# EAGLE design Motor-Board-Rev1 (EAGLE 7.6.0)

## Sheet 1 of 3
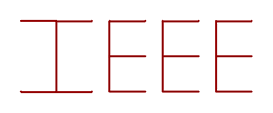
[diagram p0: schematic, sheet 1]

### Parts
U$1  LOGO  [IEEE-LOGO]

## Sheet 2 of 3
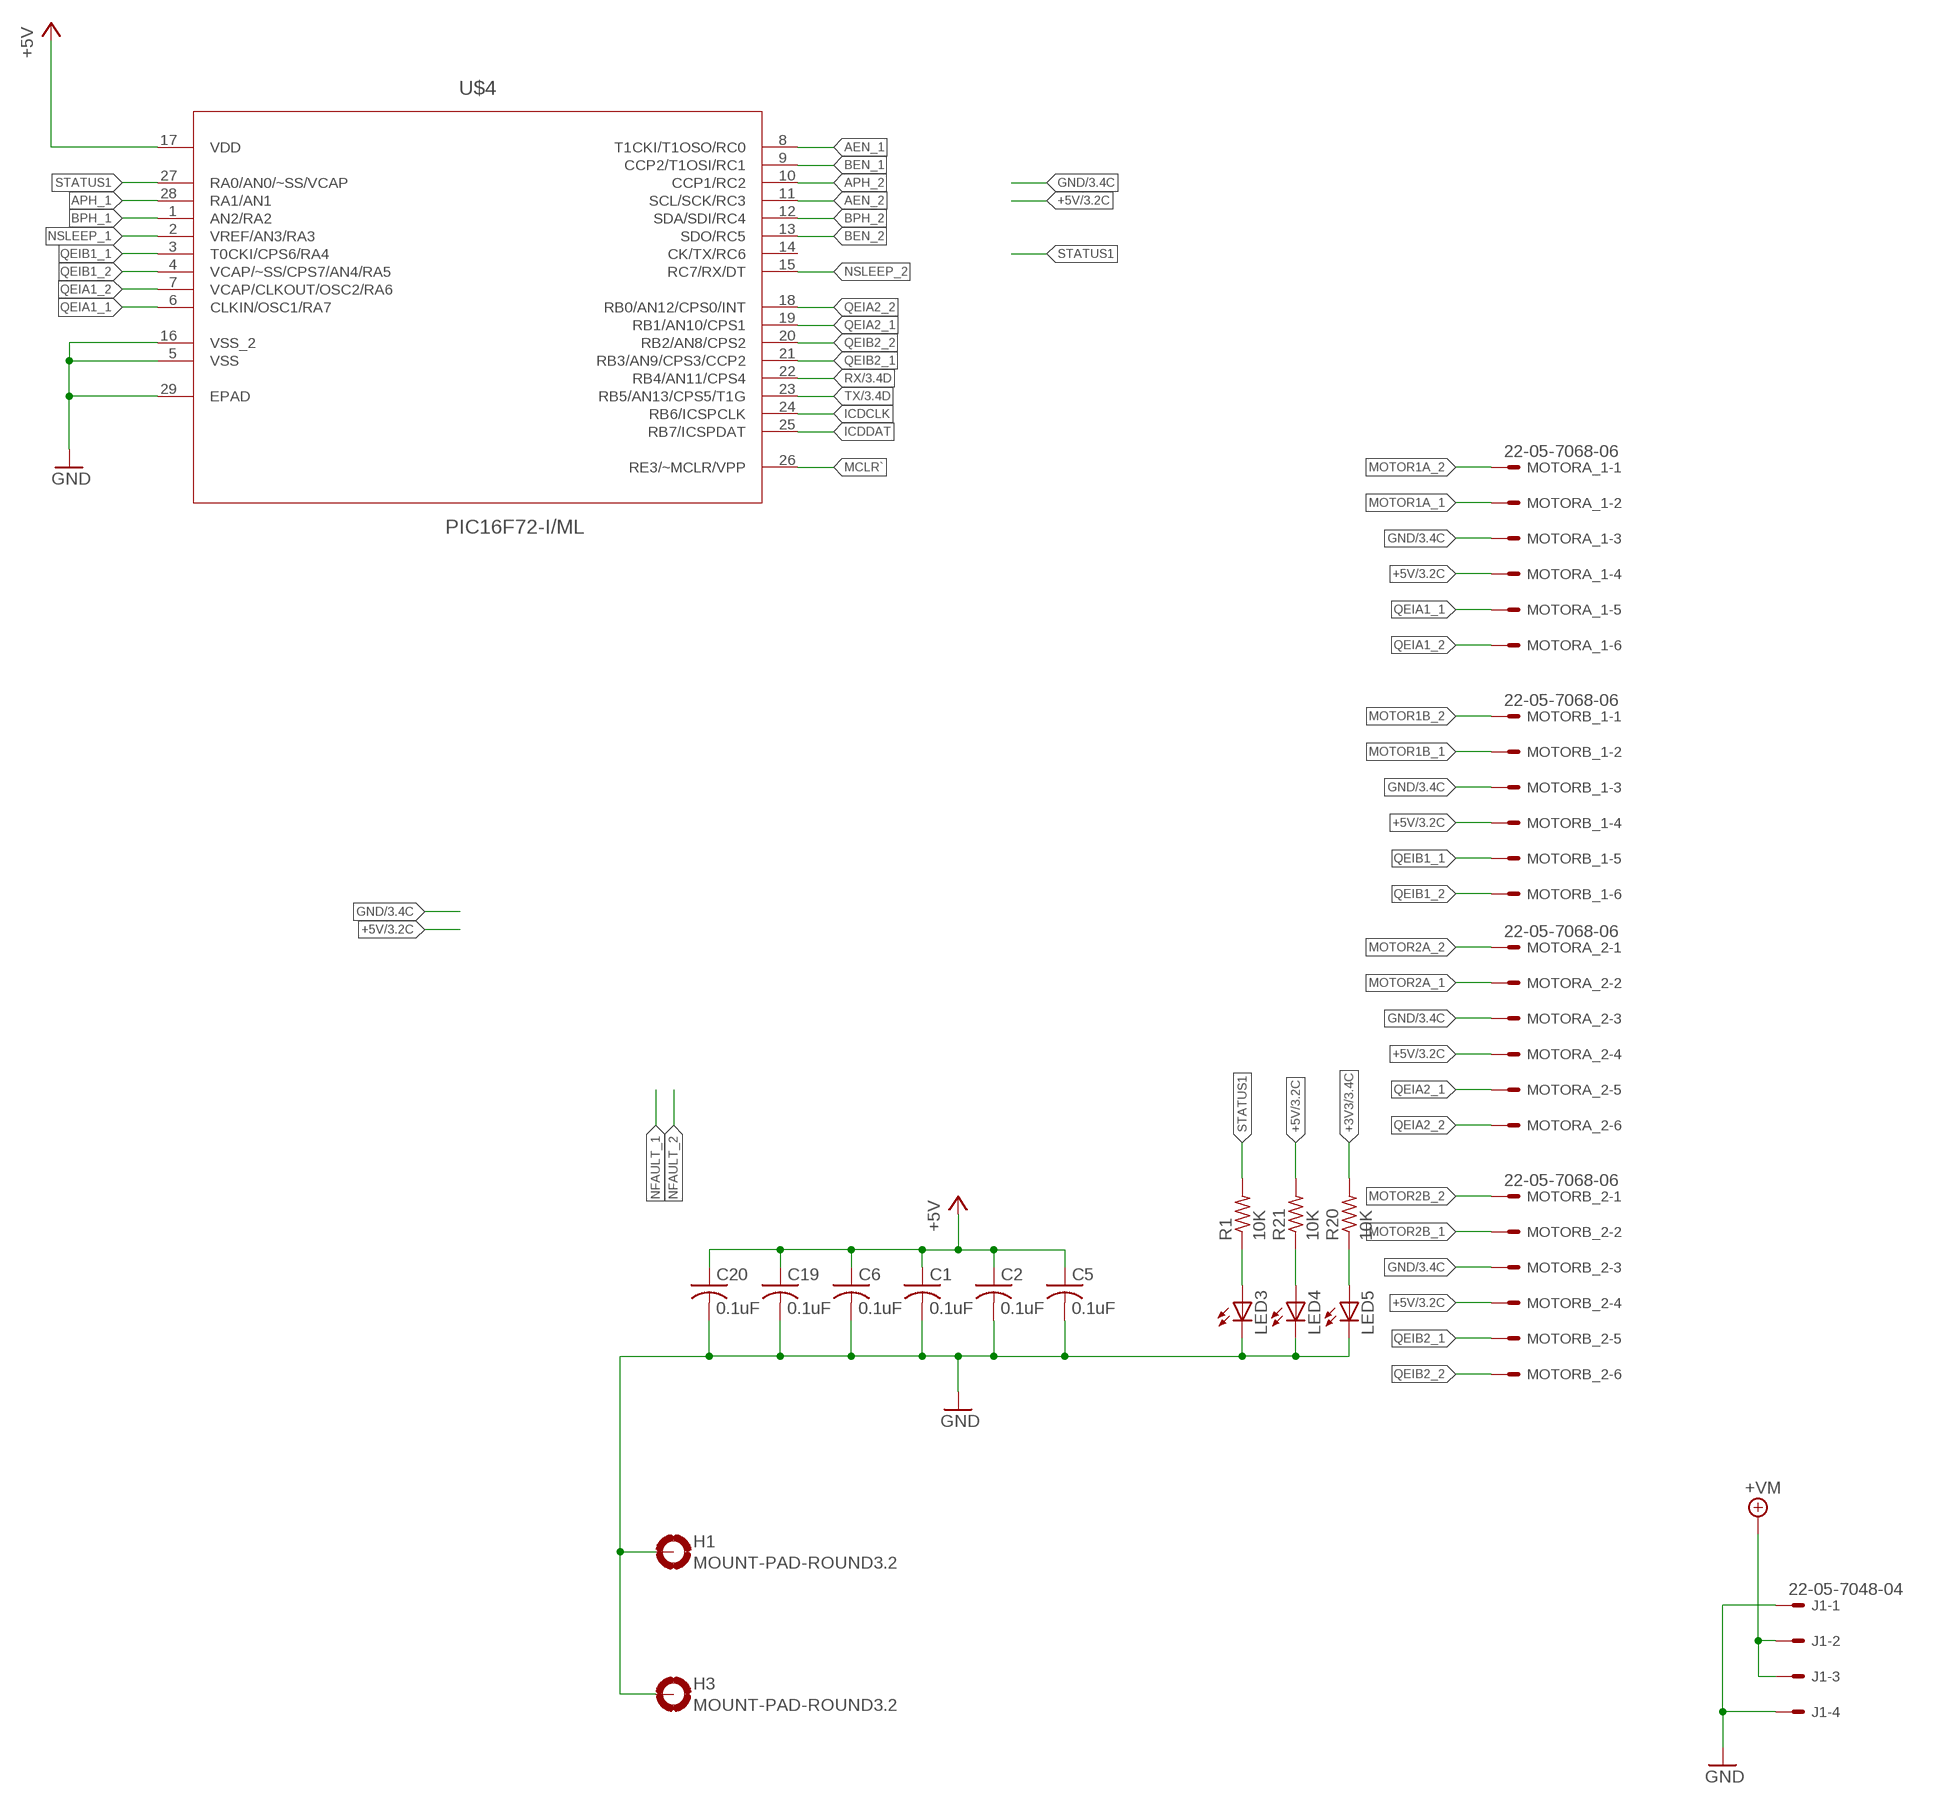
[diagram p1: schematic, sheet 2, part 1 of 2]
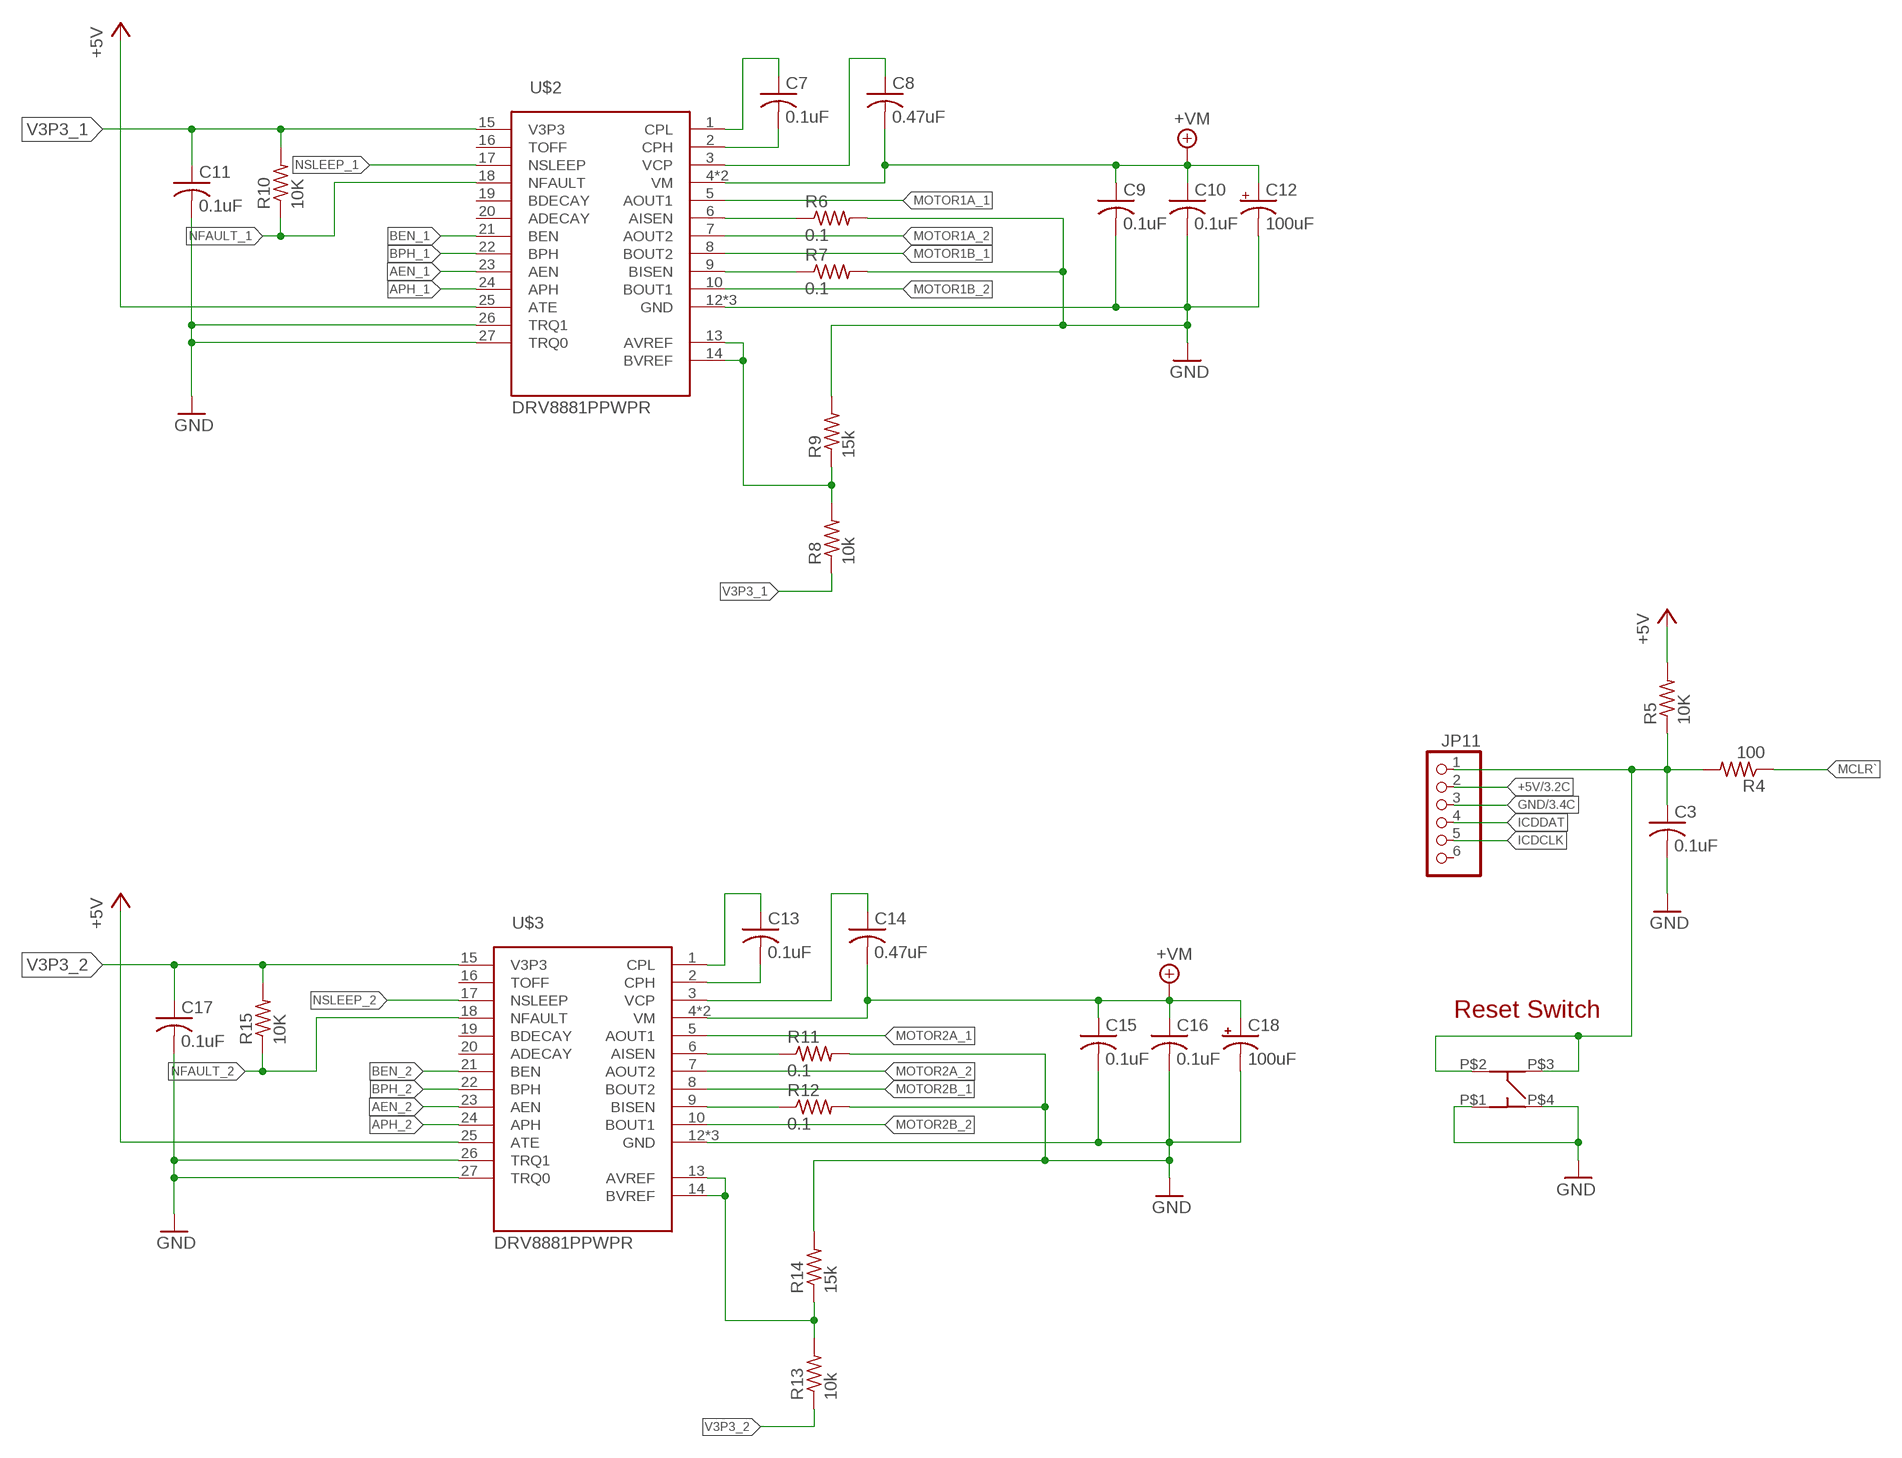
[diagram p2: schematic, sheet 2, part 2 of 2]

### Parts
C1  0.1uF  C-USC0805  [C0805]
C2  0.1uF  C-USC0805  [C0805]
C3  0.1uF  C-USC0805  [C0805]
C5  0.1uF  C-USC0805  [C0805]
C6  0.1uF  C-USC0805  [C0805]
C7  0.1uF  C-USC0402  [C0402]
C8  0.47uF  C-USC0402  [C0402]
C9  0.1uF  C-USC0402  [C0402]
C10  0.1uF  C-USC0402  [C0402]
C11  0.1uF  C-USC0402  [C0402]
C12  100uF  100UF-10V-10%(TANT)  [EIA7343]
C13  0.1uF  C-USC0402  [C0402]
C14  0.47uF  C-USC0402  [C0402]
C15  0.1uF  C-USC0402  [C0402]
C16  0.1uF  C-USC0402  [C0402]
C17  0.1uF  C-USC0402  [C0402]
C18  100uF  100UF-10V-10%(TANT)  [EIA7343]
C19  0.1uF  C-USC0805  [C0805]
C20  0.1uF  C-USC0805  [C0805]
H1  MOUNT-PAD-ROUND3.2  [3,2-PAD]
H3  MOUNT-PAD-ROUND3.2  [3,2-PAD]
J1  22-05-7048-04  [7395-04]
JP11  PINHD-1X6/90  [1X06/90]
LED3  LEDSML0603  [SML0603]
LED4  LEDSML0603  [SML0603]
LED5  LEDSML0603  [SML0603]
MOTORA_1  22-05-7068-06  [7395-06]
MOTORA_2  22-05-7068-06  [7395-06]
MOTORB_1  22-05-7068-06  [7395-06]
MOTORB_2  22-05-7068-06  [7395-06]
R1  10K  R-US_R0805  [R0805]
R4  100  R-US_R0805  [R0805]
R5  10K  R-US_R0805  [R0805]
R6  0.1  R-US_R1206  [R1206]
R7  0.1  R-US_R1206  [R1206]
R8  10k  R-US_R0402  [R0402]
R9  15k  R-US_R0402  [R0402]
R10  10K  R-US_R1206  [R1206]
R11  0.1  R-US_R1206  [R1206]
R12  0.1  R-US_R1206  [R1206]
R13  10k  R-US_R0402  [R0402]
R14  15k  R-US_R0402  [R0402]
R15  10K  R-US_R1206  [R1206]
R20  10K  R-US_R0805  [R0805]
R21  10K  R-US_R0805  [R0805]
TOUCH_RESET  RESET  MC32882_SW  [MC32882_FINAL]
U$2  DRV8881PPWPR  [TSSOP-28]
U$3  DRV8881PPWPR  [TSSOP-28]
U$4  PIC16F72-I/ML  [QFN65P600X600X100-28N]

### Nets
+3V3: R20.2 ; also sheet 3
+5V: C1.1 C2.1 C5.1 C6.1 C19.1 C20.1 JP11.2 MOTORA_1.4 MOTORA_2.4 MOTORB_1.4 MOTORB_2.4 R5.2 R21.2 U$2.25(ATE) U$3.25(ATE) U$4.17(VDD) ; also sheet 3
+7V [VM]: C8.2 C9.1 C10.1 C12.A(+) C14.2 C15.1 C16.1 C18.A(+) J1.2 J1.3 U$2.4(VM) U$2.11(VM) U$3.4(VM) U$3.11(VM) ; supply symbol labelled +VM
AEN_1: U$2.23(AEN) U$4.8(T1CKI/T1OSO/RC0)
AEN_2: U$3.23(AEN) U$4.11(SCL/SCK/RC3)
APH_1: U$2.24(APH) U$4.28(RA1/AN1)
APH_2: U$3.24(APH) U$4.10(CCP1/RC2)
BEN_1: U$2.21(BEN) U$4.9(CCP2/T1OSI/RC1)
BEN_2: U$3.21(BEN) U$4.13(SDO/RC5)
BPH_1: U$2.22(BPH) U$4.1(AN2/RA2)
BPH_2: U$3.22(BPH) U$4.12(SDA/SDI/RC4)
GND: C1.2 C2.2 C3.2 C5.2 C6.2 C9.2 C10.2 C11.2 C12.C(-) C15.2 C16.2 C17.2 C18.C(-) C19.2 C20.2 H1.B3,2(MOUNT) H3.B3,2(MOUNT) J1.1 J1.4 JP11.3 LED3.C LED4.C LED5.C MOTORA_1.3 MOTORA_2.3 MOTORB_1.3 MOTORB_2.3 R6.2 R7.2 R9.2 R11.2 R12.2 R14.2 TOUCH_RESET.P$1(P1) TOUCH_RESET.P$4(P4) U$2.12(GND) U$2.26(TRQ1) U$2.27(TRQ0) U$2.28(GND) U$2.EXP(GND) U$3.12(GND) U$3.26(TRQ1) U$3.27(TRQ0) U$3.28(GND) U$3.EXP(GND) U$4.5(VSS) U$4.16(VSS_2) U$4.29(EPAD) ; also sheet 3
ICDCLK: JP11.5 U$4.24(RB6/ICSPCLK)
ICDDAT: JP11.4 U$4.25(RB7/ICSPDAT)
MCLR: C3.1 JP11.1 R4.2 R5.1 TOUCH_RESET.P$2(P2) TOUCH_RESET.P$3(P3)
MCLR`: R4.1 U$4.26(RE3/~MCLR/VPP)
MOTOR1A_1: MOTORA_1.2 U$2.5(AOUT1)
MOTOR1A_2: MOTORA_1.1 U$2.7(AOUT2)
MOTOR1B_1: MOTORB_1.2 U$2.8(BOUT2)
MOTOR1B_2: MOTORB_1.1 U$2.10(BOUT1)
MOTOR2A_1: MOTORA_2.2 U$3.5(AOUT1)
MOTOR2A_2: MOTORA_2.1 U$3.7(AOUT2)
MOTOR2B_1: MOTORB_2.2 U$3.8(BOUT2)
MOTOR2B_2: MOTORB_2.1 U$3.10(BOUT1)
N$1: LED3.A R1.1
N$4: R7.1 U$2.9(BISEN)
N$5: LED5.A R20.1
N$8: LED4.A R21.1
N$11: R6.1 U$2.6(AISEN)
N$16: C7.2 U$2.2(CPH)
N$17: C7.1 U$2.1(CPL)
N$19: C8.1 U$2.3(VCP)
N$20: R8.2 R9.1 U$2.13(AVREF) U$2.14(BVREF)
N$21: R12.1 U$3.9(BISEN)
N$22: R11.1 U$3.6(AISEN)
N$27: C13.2 U$3.2(CPH)
N$28: C13.1 U$3.1(CPL)
N$29: C14.1 U$3.3(VCP)
N$30: R13.2 R14.1 U$3.13(AVREF) U$3.14(BVREF)
NFAULT_1: R10.1 U$2.18(NFAULT)
NFAULT_2: R15.1 U$3.18(NFAULT)
NSLEEP_1: U$2.17(NSLEEP) U$4.2(VREF/AN3/RA3)
NSLEEP_2: U$3.17(NSLEEP) U$4.15(RC7/RX/DT)
QEIA1_1: MOTORA_1.5 U$4.6(CLKIN/OSC1/RA7)
QEIA1_2: MOTORA_1.6 U$4.7(VCAP/CLKOUT/OSC2/RA6)
QEIA2_1: MOTORA_2.5 U$4.19(RB1/AN10/CPS1)
QEIA2_2: MOTORA_2.6 U$4.18(RB0/AN12/CPS0/INT)
QEIB1_1: MOTORB_1.5 U$4.3(T0CKI/CPS6/RA4)
QEIB1_2: MOTORB_1.6 U$4.4(VCAP/~SS/CPS7/AN4/RA5)
QEIB2_1: MOTORB_2.5 U$4.21(RB3/AN9/CPS3/CCP2)
QEIB2_2: MOTORB_2.6 U$4.20(RB2/AN8/CPS2)
RX: U$4.22(RB4/AN11/CPS4) ; also sheet 3
STATUS1: R1.2 U$4.27(RA0/AN0/~SS/VCAP)
TX: U$4.23(RB5/AN13/CPS5/T1G) ; also sheet 3
V3P3_1: C11.1 R8.1 R10.2 U$2.15(V3P3)
V3P3_2: C17.1 R13.1 R15.2 U$3.15(V3P3)
Unconnected: JP11.6 U$2.16(TOFF) U$2.19(BDECAY) U$2.20(ADECAY) U$3.16(TOFF) U$3.19(BDECAY) U$3.20(ADECAY) U$4.14(CK/TX/RC6)

### Notes on the sheet
- Reset Switch

## Sheet 3 of 3
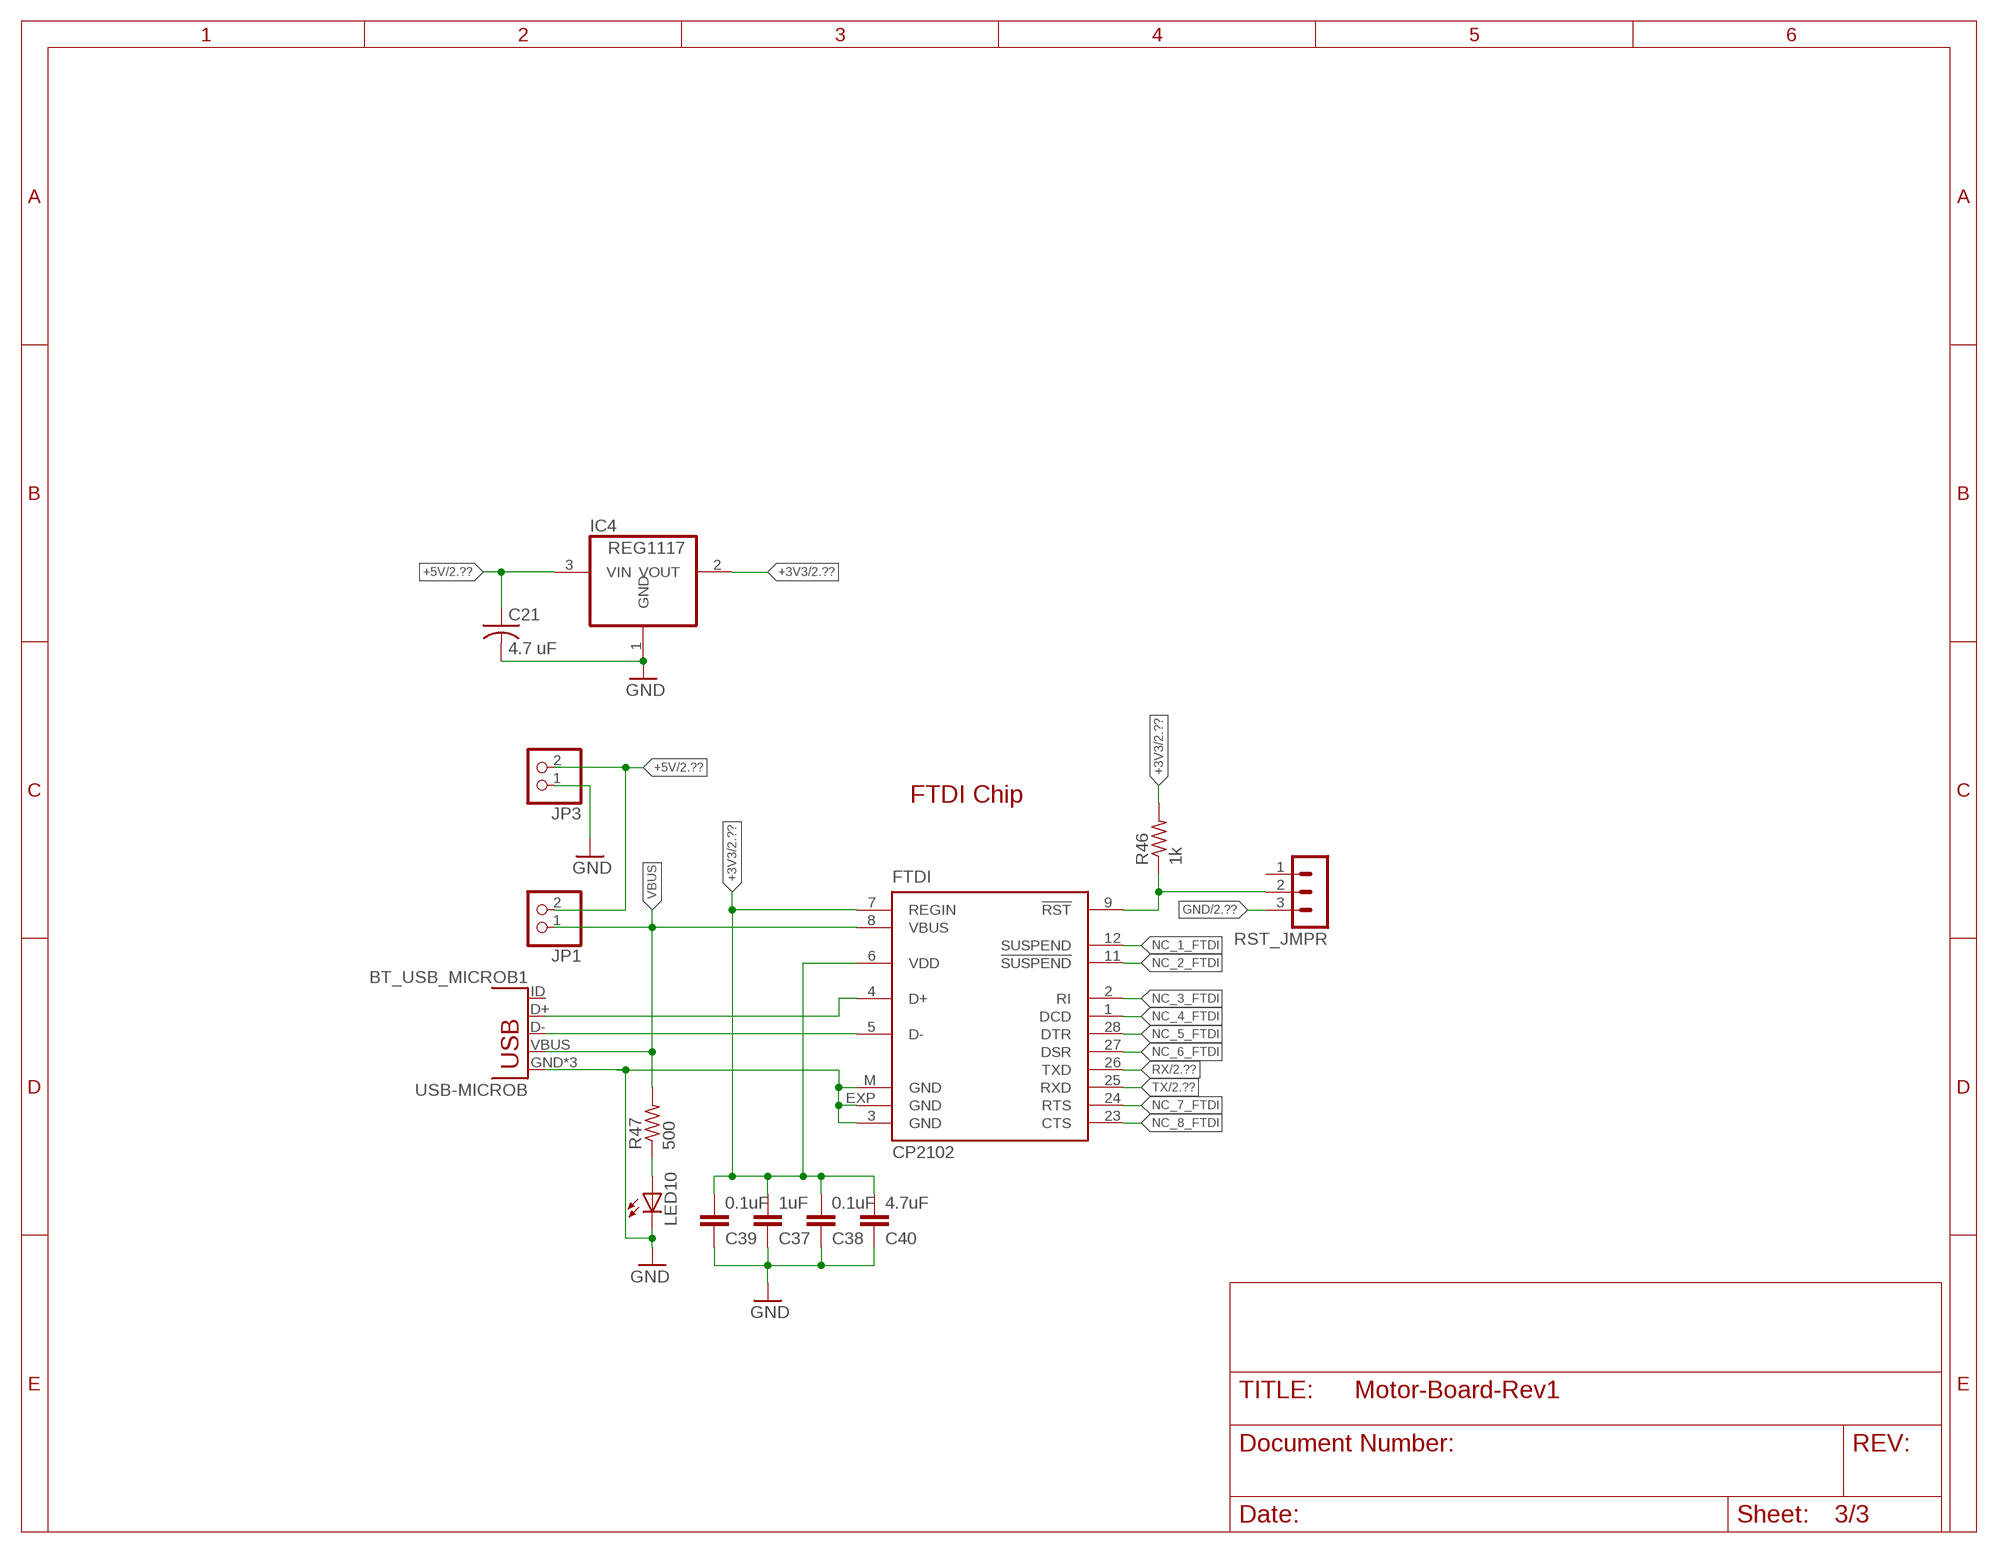
[diagram p3: schematic, sheet 3]

### Parts
BT_USB_MICROB1  USB-MICROB  [USB-MICROB]
C21  4.7 uF  C-USC0805  [C0805]
C37  1uF  C-EUC0805  [C0805]
C38  0.1uF  C-EUC0805  [C0805]
C39  0.1uF  C-EUC0805  [C0805]
C40  4.7uF  C-EUC0805  [C0805]
FTDI  CP2102  [MLP28]
IC4  REG1117  [SOT223]
JP1  PINHD-1X2  [1X02]
JP3  PINHD-1X2  [1X02]
LED10  LEDSML0603  [SML0603]
R46  1k  R-US_R0805  [R0805]
R47  500  R-US_R0805  [R0805]
RST_JMPR  MA03-1  [MA03-1]

### Nets
+3V3: C37.2 C38.2 C39.2 C40.2 FTDI.6(VDD) FTDI.7(REGIN) IC4.2(VOUT) R46.2 ; also sheet 2
+5V: C21.1 IC4.3(VIN) JP1.2 JP3.2 ; also sheet 2
BT_D+: BT_USB_MICROB1.D+ FTDI.4(D+)
BT_D-: BT_USB_MICROB1.D- FTDI.5(D-)
GND: BT_USB_MICROB1.GND BT_USB_MICROB1.MT1(GND) BT_USB_MICROB1.MT2(GND) C21.2 C37.1 C38.1 C39.1 C40.1 FTDI.3(GND) FTDI.EXP(GND) FTDI.M(GND) IC4.1(GND) JP3.1 LED10.C RST_JMPR.3 ; also sheet 2
N$9: FTDI.9(!RST) R46.1 RST_JMPR.2
N$10: LED10.A R47.1
NC_1_FTDI: FTDI.12(SUSPEND)
NC_2_FTDI: FTDI.11(!SUSPEND)
NC_3_FTDI: FTDI.2(RI)
NC_4_FTDI: FTDI.1(DCD)
NC_5_FTDI: FTDI.28(DTR)
NC_6_FTDI: FTDI.27(DSR)
NC_7_FTDI: FTDI.24(RTS)
NC_8_FTDI: FTDI.23(CTS)
RX: FTDI.26(TXD) ; also sheet 2
TX: FTDI.25(RXD) ; also sheet 2
VBUS: BT_USB_MICROB1.VBUS FTDI.8(VBUS) JP1.1 R47.2
Unconnected: BT_USB_MICROB1.ID RST_JMPR.1

### Notes on the sheet
- FTDI Chip

## Library data of the parts
BT_USB_MICROB1 = Mother-Board-rev5:USB: USB Connectors USB-B-PTH is fully proven SKU : PRT-00139/CONN-08278 USB-miniB is fully proven SKU : PRT-00587 USB-A-PCB is untested. USB-A-H is throughly reviewed, but untested. Spark Fun Electronics SKU : PRT-00437 USB-B-SMT is throughly reviewed, but untested. Needs silkscreen touching up. USB-A-S has not been used/tested USB-MB-H has not been used/tested USB-MICROB has been used. CONN-09505; PROD_ID: CONN-09505
C1-C3 C5-C11 C13-C17 C19-C21 = rcl:C-US: CAPACITOR, American symbol
C12 C18 = SparkFun-Capacitors:100UF-10V-10%(TANT): CAP-07890; PROD_ID: CAP-07890
C37-C40 = resistor:C-EU: CAPACITOR, European symbol
FTDI = silabs:CP210*: Single-Chip USB to UART Bridge Source: www.silabs.com .. CP2101.pdf / cp2102.pdf; MF: FARNELL; MPN: CP2102-GM; OC_FARNELL: 9282130; OC_NEWARK: 30K5635
H1 H3 = holes:MOUNT-PAD-ROUND: MOUNTING PAD, round
IC4 = burr-brown:REG1117: 800mA and 1A Low Dropout (LDO) Positive Regulator 1.8V, 2.5V, 2.85V, 3.3V, 5V, and Adj; MPN: REG1117; OC_FARNELL: 1097566; OC_NEWARK: 14P6981
J1 = con-molex:22-?-04: CONNECTOR wire to board 2.54 mm (.1 inch) pitch header; OC_FARNELL: unknown; OC_NEWARK: unknown
JP1 JP3 = pinhead:PINHD-1X2: PIN HEADER
JP11 = pinhead:PINHD-1X6: PIN HEADER
LED3-LED5 LED10 = interface_board-rev13:LED: LED OSRAM: - CHIPLED LG R971, LG N971, LY N971, LG Q971, LY Q971, LO R971, LY R971 LH N974, LH R974 LS Q976, LO Q976, LY Q976 LO Q996 - Hyper CHIPLED LW Q18S LB Q993, LB Q99A, LB R99A - SideLED LS A670, LO A670, LY A670, LG A670, LP A670 LB A673, LV A673, LT A673, LW A673 LH A674 LY A675 LS A676, LA A676, LO A676, LY A676, LW A676 LS A679, LY A679, LG A679 - Hyper Micro SIDELED® LS Y876, LA Y876, LO Y876, LY Y876 LT Y87S - SmartLED LW L88C, LW L88S LB L89C, LB L89S, LG L890 LS L89K, LO L89K, LY L89K LS L896, LA L896, LO L896, LY L896 - TOPLED LS T670, LO T670, LY T670, LG T670, LP T670 LSG T670, LSP T670, LSY T670, LOP T670, LYG T670 LG T671, LOG T671, LSG T671 LB T673, LV T673, LT T673, LW T673 LH T674 LS T676, LA T676, LO T676, LY T676, LB T676, LH T676, LSB T676, LW T676 LB T67C, LV T67C, LT T67C, LS T67K, LO T67K, LY T67K, LW E67C LS E67B, LA E67B, LO E67B, LY E67B, LB E67C, LV E67C, LT E67C LW T67C LS T679, LY T679, LG T679 LS T770, LO T770, LY T770, LG T770, LP T770 LB T773, LV T773, LT T773, LW T773 LH T774 LS E675, LA E675, LY E675, LS T675 LS T776, LA T776, LO T776, LY T776, LB T776 LHGB T686 LT T68C, LB T68C - Hyper Mini TOPLED® LB M676 - Mini TOPLED Santana® LG M470 LS M47K, LO M47K, LY M47K Source: http://www.osram.convergy.de LUXEON: - LUMILED® LXK2-PW12-R00, LXK2-PW12-S00, LXK2-PW14-U00, LXK2-PW14-V00 LXK2-PM12-R00, LXK2-PM12-S00, LXK2-PM14-U00 LXK2-PE12-Q00, LXK2-PE12-R00, LXK2-PE12-S00, LXK2-PE14-T00, LXK2-PE14-U00 LXK2-PB12-K00, LXK2-PB12-L00, LXK2-PB12-M00, LXK2-PB14-N00, LXK2-PB14-P00, LXK2-PB14-Q00 LXK2-PR12-L00, LXK2-PR12-M00, LXK2-PR14-Q00, LXK2-PR14-R00 LXK2-PD12-Q00, LXK2-PD12-R00, LXK2-PD12-S00 LXK2-PH12-R00, LXK2-PH12-S00 LXK2-PL12-P00, LXK2-PL12-Q00, LXK2-PL12-R00 Source: www.luxeon.com KINGBRIGHT: KA-3528ASYC Source: www.kingbright.com
MOTORA_1 MOTORA_2 MOTORB_1 MOTORB_2 = con-molex:22-?-06: CONNECTOR wire to board 2.54 mm (.1 inch) pitch header; OC_FARNELL: unknown; OC_NEWARK: unknown
R1 R4-R15 R20 R21 = rcl:R-US_: RESISTOR, American symbol
R46 R47 = resistor:R-US_: RESISTOR, American symbol
RST_JMPR = con-lstb:MA03-1: PIN HEADER; OC_FARNELL: unknown; OC_NEWARK: unknown
TOUCH_RESET = power_lib:MC32882_SW
U$1 = IEEE-logo:LOGO
U$2 U$3 = motor-driver:DRV8881PPWPR
U$4 = Microchip_By_element14_Batch_1:PIC16F72-I/ML: 28-Pin Flash Microcontrollers; DESCRIPTION: 28-Pin Flash Microcontrollers; MPN: PIC16F72-I/ML; OC_FARNELL: -; OC_NEWARK: 73K1292; PACKAGE: QFN-28; SUPPLIER: Microchip

## Net classes
2 VM: width 0.508 mm, drill 0.33 mm, clearance 0.254 mm
3 gnd: width 0.152 mm

## Board
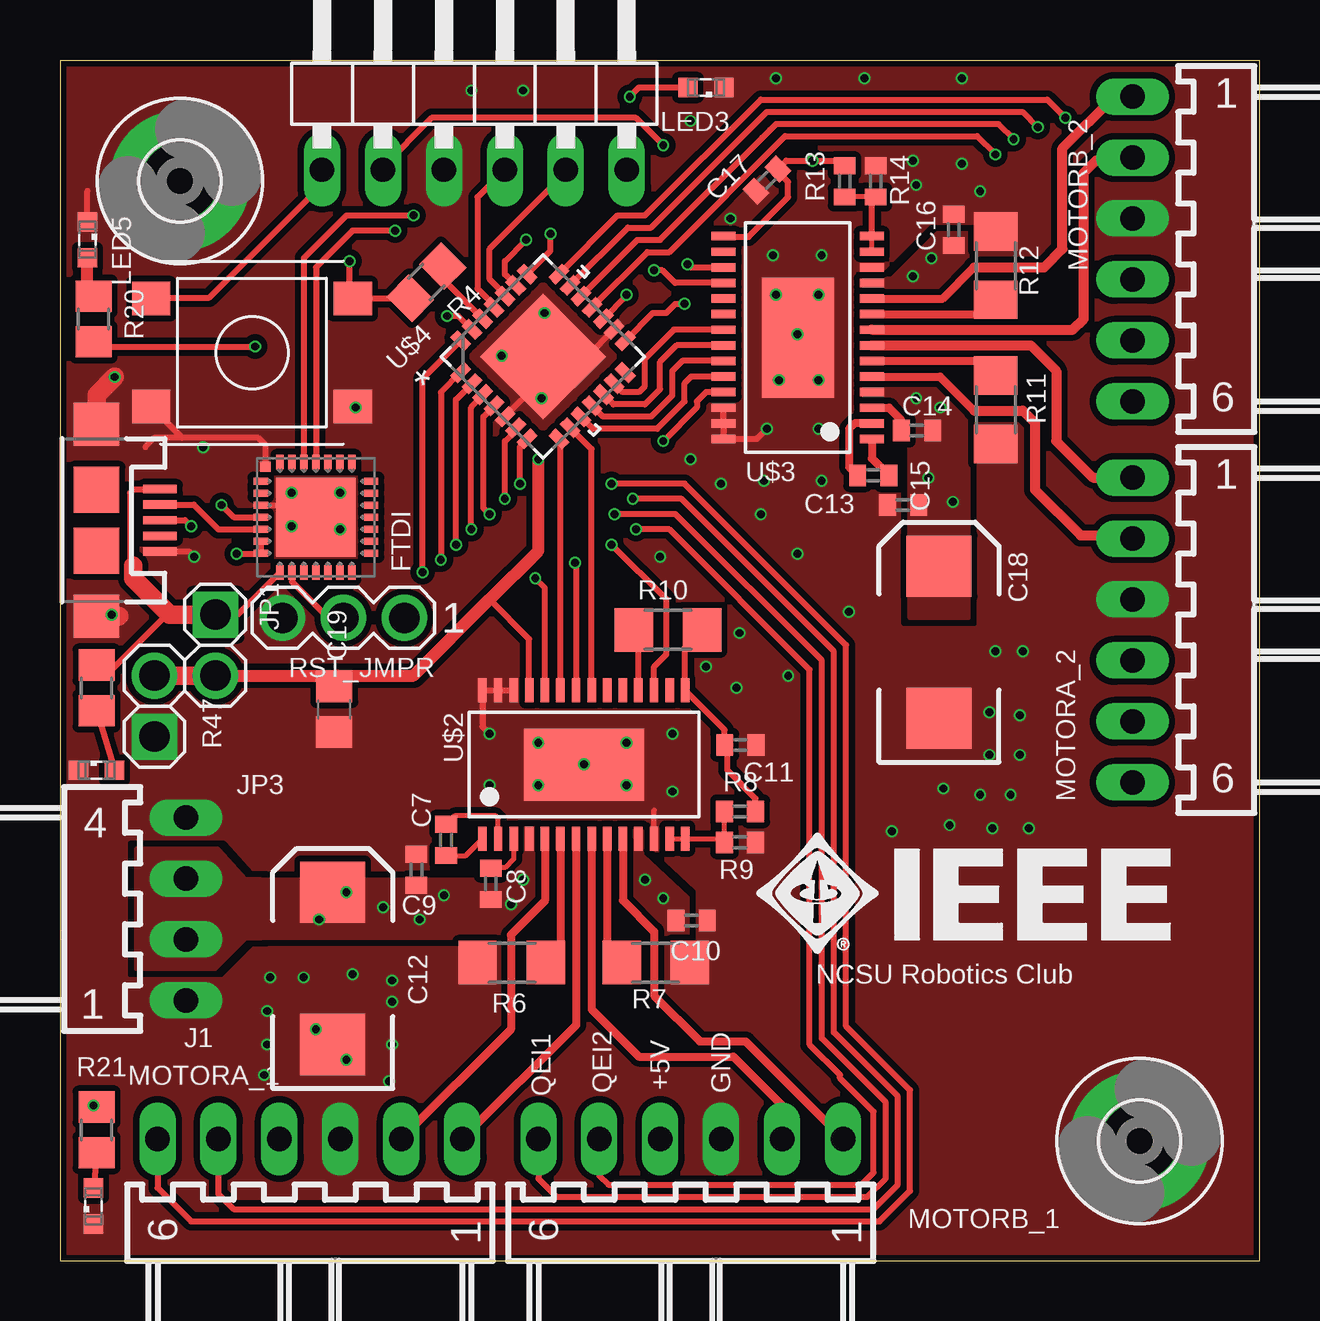
[diagram p4: board, top side]
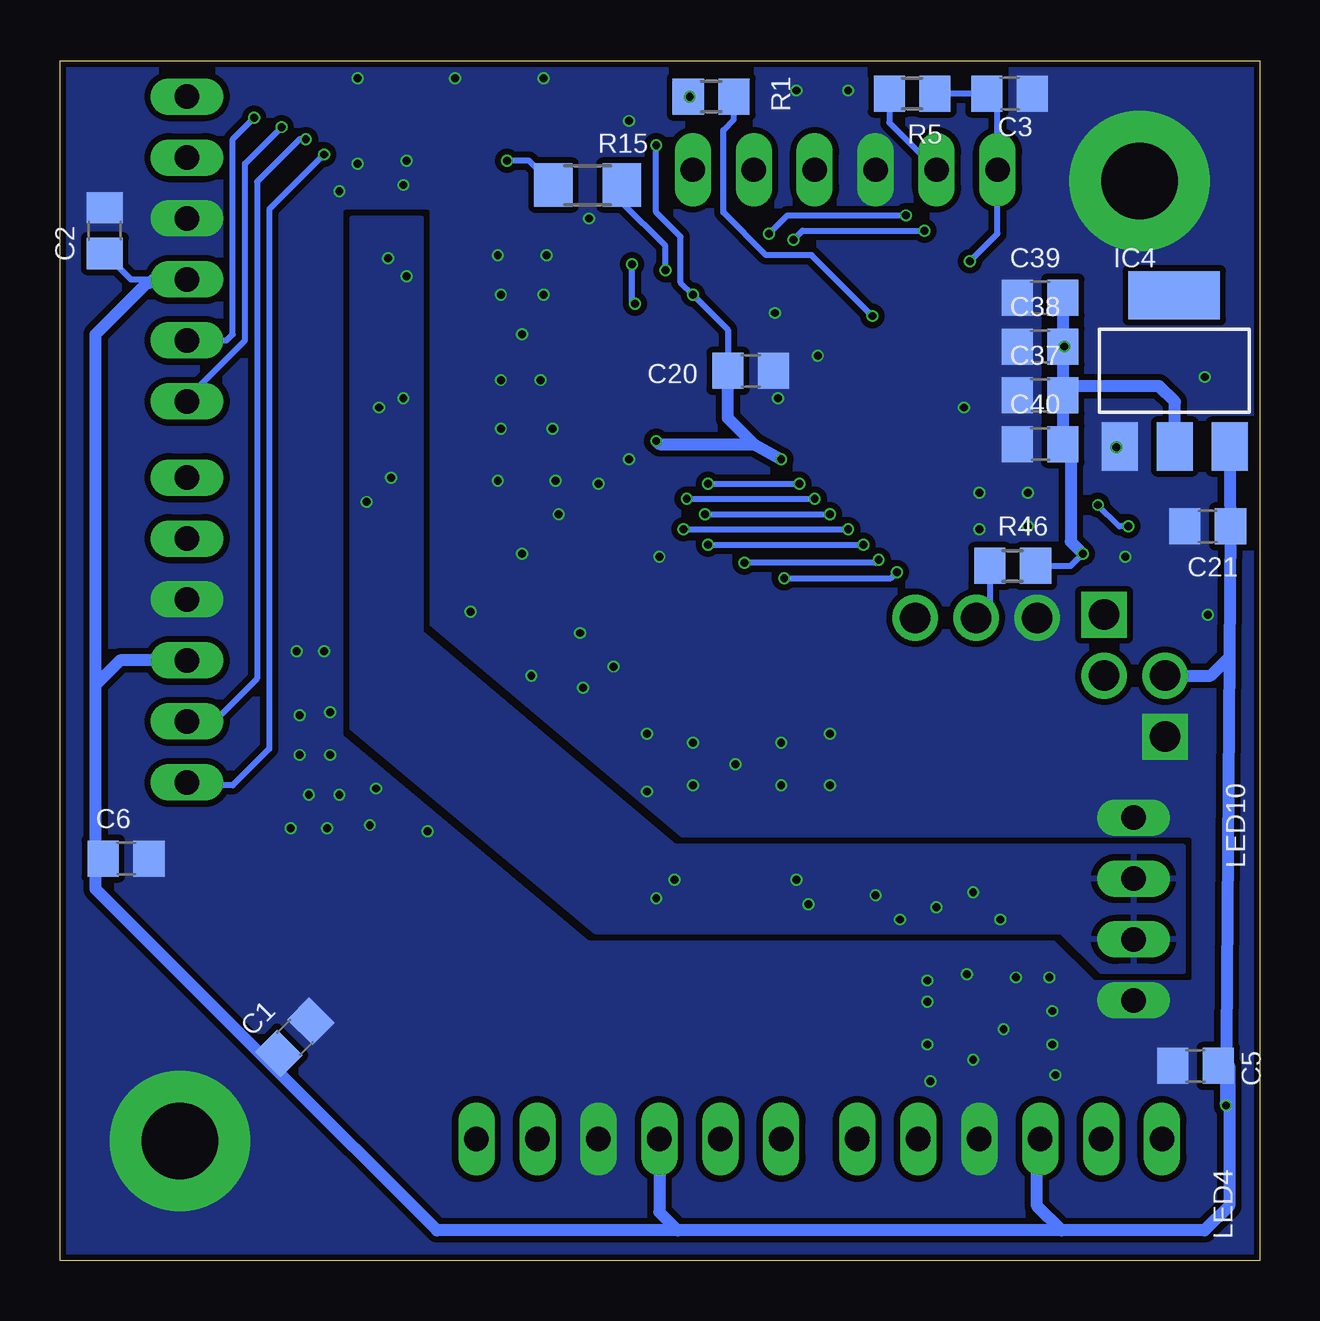
[diagram p5: board, bottom side, seen from below]

Size 50 x 50 mm. Coordinates in mm from the lower left corner, seen from the top.
Outline: 0,0 50,0 50,50 0,50 0,0
Copper layers (1*16): Top 0.035mm / dielectric 1.5mm / Bottom 0.035mm
Design rules "EagleRules-2-Layer-Shep": minimum track width 6mil, minimum drill 12mil, track to track 6mil, track to pad 6mil, pad to pad 6mil, via to via 6mil, smd to smd 0mil, copper to edge 10mil, drill to drill 10mil, minimum pad ring 2mil, minimum via ring 2mil, stop-mask expansion 2mil, vias tented up to drill 100mil, thermal gap 10mil

### Footprints (pad centres in the part's own frame; a part is rotated, then mirrored left to right if it is on the bottom)
USB-MICROB = smd 0.35 x 1.4: D+ 0,2.65; D- -0.65,2.65; GND 1.3,2.65; ID 0.65,2.65; VBUS -1.3,2.65 | smd 1.8 x 1.9: MT1 -4,0; MT2 4,0 | smd 1.9 x 1.9: P$1 -1.27,0; P$2 1.27,0
C0805 = smd 1.3 x 1.5: 1 -0.95,0; 2 0.95,0
C0402 = smd 0.7 x 0.9: 1 -0.65,0; 2 0.65,0
EIA7343 = smd 2.55 x 2.7: A 3.17,0; C -3.17,0
MLP28 = smd 0.6 x 0.3: 1 -2.3,1.5; 2 -2.3,1; 3 -2.3,0.5; 4 -2.3,0; 5 -2.3,-0.5; 6 -2.3,-1; 7 -2.3,-1.5; 15 2.3,-1.5; 16 2.3,-1; 17 2.3,-0.5; 18 2.3,0; 19 2.3,0.5; 20 2.3,1; 21 2.3,1.5 | smd 0.3 x 0.6: 8 -1.5,-2.3; 9 -1,-2.3; 10 -0.5,-2.3; 11 0,-2.3; 12 0.5,-2.3; 13 1,-2.3; 14 1.5,-2.3; 22 1.5,2.3; 23 1,2.3; 24 0.5,2.3; 25 0,2.3; 26 -0.5,2.3; 27 -1,2.3; 28 -1.5,2.3 | smd 3.3 x 3.3: EXP 0,0 | smd 0.435 x 0.435: M -2.103,2.103
3,2-PAD = drill 3.2 pad 5.842: B3,2 0,0
SOT223 = smd 1.499 x 2.007: 1 -2.261,-3.15; 2 0.025,-3.15; 3 2.311,-3.15 | smd 3.81 x 2.007: 4 0,3.15
7395-04 = drill 1.016 long: 1 3.81,0; 2 1.27,0; 3 -1.27,0; 4 -3.81,0
1X02 = drill 1.27 square: 1 -1.27,0 | drill 1.27: 2 1.27,0
1X06/90 = drill 1.016 long: 1 -6.35,-3.81; 2 -3.81,-3.81; 3 -1.27,-3.81; 4 1.27,-3.81; 5 3.81,-3.81; 6 6.35,-3.81
SML0603 = smd 0.8 x 0.8: A 0.75,0; C -0.75,0
7395-06 = drill 1.016 long: 1 6.35,0; 2 3.81,0; 3 1.27,0; 4 -1.27,0; 5 -3.81,0; 6 -6.35,0
R0805 = smd 1.3 x 1.5: 1 -0.95,0; 2 0.95,0
R1206 = smd 1.6 x 1.803: 1 -1.422,0; 2 1.422,0
R0402 = smd 0.7 x 0.9: 1 -0.65,0; 2 0.65,0
MA03-1 = drill 1.27: 1 -2.54,0; 2 0,0; 3 2.54,0
MC32882_FINAL = smd 1.6 x 1.4: P$1 -4.2,-2.25; P$2 -4.2,2.25; P$3 4.2,2.25; P$4 4.2,-2.25
TSSOP-28 = smd 0.35 x 1: 1 -4.225,-3.087; 2 -3.575,-3.087; 3 -2.925,-3.087; 4 -2.275,-3.087; 5 -1.625,-3.087; 6 -0.975,-3.087; 7 -0.325,-3.087; 8 0.325,-3.087; 9 0.975,-3.087; 10 1.625,-3.087; 11 2.275,-3.087; 12 2.925,-3.087; 13 3.575,-3.087; 14 4.225,-3.087; 15 4.225,3.087; 16 3.575,3.087; 17 2.925,3.087; 18 2.275,3.087; 19 1.625,3.087; 20 0.975,3.087; 21 0.325,3.087; 22 -0.325,3.087; 23 -0.975,3.087; 24 -1.625,3.087; 25 -2.275,3.087; 26 -2.925,3.087; 27 -3.575,3.087; 28 -4.225,3.087 | smd 5 x 3: EXP 0,0
QFN65P600X600X100-28N = smd 0.813 x 0.432: 1 -2.896,1.956; 2 -2.896,1.295; 3 -2.896,0.66; 4 -2.896,0; 5 -2.896,-0.66; 6 -2.896,-1.295; 7 -2.896,-1.956; 15 2.896,-1.956; 16 2.896,-1.295; 17 2.896,-0.66; 18 2.896,0; 19 2.896,0.66; 20 2.896,1.295; 21 2.896,1.956 | smd 0.432 x 0.813: 8 -1.956,-2.896; 9 -1.295,-2.896; 10 -0.66,-2.896; 11 0,-2.896; 12 0.66,-2.896; 13 1.295,-2.896; 14 1.956,-2.896; 22 1.956,2.896; 23 1.295,2.896; 24 0.66,2.896; 25 0,2.896; 26 -0.66,2.896; 27 -1.295,2.896; 28 -1.956,2.896 | smd 3.708 x 3.708: 29 0,0

### Placement (x,y rotation side)
BT_USB_MICROB1  1.52,30.86 270 top
C1  40.21,9.31 45 bottom
C2  48.13,42.93 90 bottom
C3  10.41,48.64 0 bottom
C5  2.67,8.13 180 bottom
C6  47.24,16.76 0 bottom
C7  16.09,17.54 90 top
C8  17.96,15.71 270 top
C9  14.86,16.3 90 top
C10  26.32,14.18 0 top
C11  28.36,21.5 0 top
C12  11.37,12.19 90 top
C13  33.9,32.73 180 top
C14  35.72,34.6 0 top
C15  35.14,31.5 180 top
C16  37.25,42.96 90 top
C17  29.46,45.03 225 top
C18  36.64,25.78 90 top
C19  11.43,22.99 270 top
C20  21.21,37.08 0 bottom
C21  2.16,30.61 180 bottom
C37  9.14,36.07 0 bottom
C38  9.14,38.1 0 bottom
C39  9.14,40.13 0 bottom
C40  9.14,34.04 0 bottom
FTDI  10.67,30.99 0 top
H1  45,5 0 top
H3  5,45 0 top
IC4  3.56,37.08 0 bottom
J1  5.25,14.66 270 top
JP1  6.48,25.65 270 top
JP3  3.94,23.11 90 top
JP11  17.27,49.28 0 top
LED3  26.92,48.9 180 top
LED4  1.4,2.29 90 top
LED5  1.14,42.55 270 top
LED10  1.52,20.45 0 top
MOTORA_1  10.41,5.08 0 top
MOTORA_2  44.7,26.29 90 top
MOTORB_1  26.29,5.08 0 top
MOTORB_2  44.7,42.16 90 top
R1  22.86,48.51 0 bottom
R4  15.28,40.78 225 top
R5  14.48,48.64 180 bottom
R6  18.83,12.43 180 top
R7  24.83,12.43 0 top
R8  28.34,18.73 180 top
R9  28.34,17.44 0 top
R10  25.34,26.29 0 top
R11  39,35.47 270 top
R12  39,41.47 90 top
R13  32.7,44.98 270 top
R14  33.99,44.98 90 top
R15  28.01,44.83 180 bottom
R20  1.4,39.24 270 top
R21  1.52,5.46 90 top
R46  10.29,28.96 0 bottom
R47  1.52,23.88 90 top
RST_JMPR  11.81,26.8 180 top
TOUCH_RESET  8,37.85 0 top
U$1  37.21,15.24 0 top
U$2  21.84,20.68 0 top
U$3  30.75,38.47 90 top
U$4  20.13,37.68 45 top

### Tracks (layer width: path | path; a pad name or v marks a point on that pad's centre or on a via)
+3V3  (via drill 0.33)
  Top 0.254: v7.37,29.46 8.34,29.46 FTDI.7 FTDI.6 | R20.2 1.59,38.1 v8.13,38.1
  Bottom 0.254: 7.87,33.72 C40.2 | R46.2 7.87,28.96 v7.37,29.46 | C38.2 v8.13,38.1
  Bottom 0.508: C39.2 C38.2 C37.2 | C37.2 C40.2 | 7.87,33.72 7.87,29.97 v7.37,29.46 | IC4.2 3.53,35.79 4.19,36.45 7.81,36.45 C37.2
  Bottom 0.762: 8.15,34.08 C40.2
+5V  (via drill 0.33)
  Top 0.254: U$4.17 23.62,40.24 v23.62,40.26 | U$3.25 26.93,36.2 26.54,35.81 26.54,35.56 v25.15,34.16 | U$2.25 19.56,25.9 17.91,27.56 | R21.2 1.46,6.6 v1.4,6.48 | C19.1 11.56,24.06 11.56,24.38 | v25.15,46.48 24,47.62 15.49,47.62 13.46,45.59 JP11.2
  Top 0.508: JP1.2 11.56,24.38 14.73,24.38 17.91,27.56 19.94,29.59 v19.94,33.4
  Top 0.762: 3.56,24.38 JP3.2 JP1.2
  Bottom 0.254: C20.1 22.16,38.8 v23.62,40.26 24.13,40.77 24.13,42.67 25.15,43.69 v25.15,46.48 | C1.1 41.21,8.31 41.21,8.19 | C2.1 47.05,40.89 45.72,40.89 | C6.1 48.51,16.76 | R5.2 15.43,47.43 JP11.2
  Bottom 0.508: v19.94,33.4 21.08,34.04 | 21.08,34.04 22.16,35.11 C20.1 | v25.15,34.16 25.02,34.04 21.08,34.04 | JP3.2 2.03,24.38 1.27,25.15 | 1.27,25.15 C21.1 1.27,33.91 IC4.3 | 1.27,25.15 v1.4,6.48 1.27,8.13 | 1.27,8.13 1.27,2.29 2.29,1.27 8.26,1.27 | 8.26,1.27 9.27,2.29 9.27,4.95 MOTORA_1.4 | 8.26,1.27 24.26,1.27 | 24.26,1.27 34.29,1.27 41.21,8.19 48.51,15.49 48.51,16.76 48.51,24 | 48.51,24 48.51,38.61 46.35,40.77 46.23,40.77 46.1,40.89 45.72,40.89 MOTORB_2.4 | MOTORA_2.4 47.5,25.02 48.51,24 | MOTORB_1.4 25.02,2.03 24.26,1.27 | C5.1 1.27,8.13
+7V  (via drill 0.33)
  other vias: 35.56,41.02 36.32,41.78 35.69,35.94 36.7,35.56 37.21,31.62 36.2,32.64 24.38,15.88 25.15,15.11 19.3,15.88 18.8,14.86 16,15.24 14.99,14.22 13.46,14.73 11.94,15.37 10.79,14.22
  pour Top (isolate 0.254, no thermals): 19.3,18.03 20.07,18.03 20.07,14.86 19.94,14.86 18.54,13.46 7.75,13.46 7.75,15.88 18.41,15.88 19.3,16.76
  pour Top (isolate 0.254, no thermals): 23.88,17.91 23.88,14.48 24.77,13.59 26.16,13.59 26.16,15.11 24.26,16.89 24.26,17.91
  pour Top (isolate 0.254, no thermals): 8.38,15.88 7.75,15.88 6.6,17.14 3.17,17.14 3.17,12.19 6.48,12.19 7.75,13.46 8.38,13.46
  pour Top (isolate 0.254, no thermals): 35.43,26.8 35.43,34.92 34.42,35.94 33.53,35.94 33.53,36.45 36.58,36.45 37.85,35.18 37.85,26.8
  pour Top (isolate 0.254, no thermals): 33.53,40.39 37.08,40.39 37.85,41.15 37.85,42.8 36.58,42.8 34.67,40.89 33.53,40.89
  pour Bottom: 3.17,17.27 24.38,17.27 34.92,26.16 34.92,43.43 37.85,43.43 37.85,22.23 27.69,13.72 8.26,13.72 6.6,12.06 3.17,12.06
AEN_1
  Top 0.254: U$2.23 20.86,34.19 U$4.8
AEN_2
  Top 0.254: U$3.23 25.94,37.5 25.53,37.08 25.53,36.07 24.64,35.18 22.64,35.18 U$4.11
APH_1  (via drill 0.33)
  Top 0.254: U$2.24 20.21,28.05 v19.81,28.45 | v15.11,28.7 15.11,36.76 U$4.28
  Bottom 0.254: v19.81,28.45 15.37,28.45 v15.11,28.7
APH_2
  Top 0.254: U$3.24 26.31,36.85 26.04,36.58 26.04,35.81 24.89,34.67 22.21,34.67 U$4.10
BEN_1
  Top 0.254: U$2.21 22.16,33.82 U$4.9
BEN_2
  Top 0.254: U$3.21 25.59,38.8 24.38,37.59 24.38,36.45 24.13,36.2 23.45,36.2 U$4.13
BPH_1  (via drill 0.33)
  Top 0.254: U$4.1 15.88,36.19 v15.88,29.21 | v21.46,29.08 21.51,29.03 U$2.22
  Bottom 0.254: v15.88,29.21 16,29.08 v21.46,29.08
BPH_2
  Top 0.254: U$3.22 25.7,38.15 25.02,37.47 25.02,36.32 24.38,35.69 23.06,35.69 U$4.12
BT_D+  (via drill 0.33)
  Top 0.254: BT_USB_MICROB1.D+ 5.21,30.86 v5.46,30.61 | v6.73,31.5 7.24,30.99 FTDI.4
  Bottom 0.254: v5.46,30.61 5.84,30.61 v6.73,31.5
BT_D-
  Top 0.254: BT_USB_MICROB1.D- 5.57,31.51 6.6,30.48 FTDI.5
GND  (via drill 0.33)
  Top 0.203: C10.2 26.98,14.28 27.05,14.35 | U$2.12 24.76,18.79 24.77,18.8
  Top 0.254: BT_USB_MICROB1.GND 5.36,29.56 v5.59,29.34 | FTDI.3 10.15,31.5 9.65,31.5 | 9.65,31.5 10.16,30.99 FTDI.EXP | 19.18,37.97 19.58,37.57 20.02,37.57 | FTDI.M 8.57,33.98 8.26,34.29 5.08,34.29 | 5.08,34.29 3.94,34.29 3.56,33.91 | 9.65,31.5 v9.65,32 | U$4.16 21.97,37.68 U$4.29 20.02,37.57 | U$4.5 18.55,35.19 19.94,36.58 18.8,37.72 v18.41,37.72 19.87,37.72 20.02,37.57 | v17.91,21.97 17.61,22.27 U$2.28 U$2.27 U$2.26 | v29.46,34.67 29.04,34.25 U$3.28 U$3.27 U$3.26 | TOUCH_RESET.P$1 5.08,34.32 5.08,34.29 | TOUCH_RESET.P$4 12.24,35.56 v12.32,35.56 | LED5.C 1.14,44.58
  Top 0.762: BT_USB_MICROB1.MT2 2.48,26.86 | BT_USB_MICROB1.MT1 1.52,36.07 v2.29,36.83
  Bottom 0.508: v9.65,32
  other vias: 21.84,20.7 23.62,21.59 23.62,19.81 19.94,19.81 19.94,21.59 17.91,19.81 25.53,21.97 25.53,19.56 31.62,34.67 31.75,32.51 29.34,32.51 29.84,40.26 31.62,40.26 29.72,41.91 31.75,41.91 30.73,38.61 31.62,36.7 29.97,36.7 9.65,30.61 11.68,30.48 11.68,32 20.19,39.5 20.07,35.94 2.16,26.92 28.19,23.88 26.92,24.77 30.35,24.38 28.32,26.16 25.02,29.34 32.89,27.05 30.73,29.46 27.56,32.38 26.29,33.4 29.21,31.11 35.56,45.85 35.69,44.83 37.59,45.72 38.35,44.58 27.94,43.43 29.84,49.28 26.29,47.5 33.53,49.28 37.59,49.28 17.14,48.77 19.3,48.77 5.97,33.91 34.67,17.91 36.83,19.68 38.73,22.86 38.73,21.08 40.01,22.73 40.01,21.08 39.62,19.43 38.35,19.43 37.08,18.16 38.86,18.03 40.39,18.03 38.99,25.4 40.13,25.4 13.72,7.49 13.84,9.02 13.84,10.79 13.84,11.68 12.19,11.94 10.16,11.81 8.76,11.81 8.64,10.41 8.64,9.02 8.51,7.75 10.67,9.65 11.94,8.38
  pour Bottom (isolate 0.254, rank 6, no thermals): -0.75,103.25 109.75,103.25 109.75,-6 -0.75,-6
  pour Top (isolate 0.254, rank 6, no thermals): -1.27,52.2 53.98,52.2 53.98,-5.97 -1.27,-5.97
ICDCLK
  Top 0.254: U$4.24 18.55,40.25 17.91,40.89 17.91,42.16 21.08,45.34 JP11.5
ICDDAT
  Top 0.254: U$4.25 18.09,39.83 17.4,40.51 17.4,44.32 JP11.4
MCLR  (via drill 0.33)
  Top 0.254: v12.06,41.66 12.06,40.23 TOUCH_RESET.P$3 12.97,40.1 12.98,40.11 R4.2 | TOUCH_RESET.P$2 3.84,40.13 6.22,40.13 10.92,44.83 JP11.1
  Bottom 0.254: v12.06,41.66 10.92,42.8 JP11.1 10.92,48.2 C3.1 R5.1
MCLR`
  Top 0.254: U$4.26 15.95,40.93 R4.1
MOTOR1A_1
  Top 0.33: U$2.5 20.21,15.01 18.8,13.59 18.8,9.65 MOTORA_1.2
MOTOR1A_2
  Top 0.33: U$2.7 21.51,9.83 MOTORA_1.1
MOTOR1B_1
  Top 0.33: U$2.8 22.16,10.48 24.13,8.51 28.07,8.51 30.1,6.48 MOTORB_1.2
MOTOR1B_2
  Top 0.33: U$2.10 23.46,15.02 24.77,13.72 24.77,11.05 26.67,9.14 28.57,9.14 MOTORB_1.1
MOTOR2A_1
  Top 0.33: U$3.5 36.68,36.85 38.1,35.43
  Top 0.406: 38.1,35.43 40.13,35.43 40.64,34.92 40.64,32.13 42.55,30.23 44.58,30.23 MOTORA_2.2
MOTOR2A_2
  Top 0.406: U$3.7 40.46,38.15 41.53,37.08 41.53,34.16 43.05,32.64 MOTORA_2.1
MOTOR2B_1
  Top 0.33: 43.18,45.85 44.58,45.85 MOTORB_2.2
  Top 0.406: U$3.8 42.23,38.8 42.67,39.24 42.67,45.34 43.18,45.85
MOTOR2B_2
  Top 0.33: U$3.10 36.8,40.1 38.1,41.4
  Top 0.406: 38.1,41.4 41.02,41.4 41.78,42.16 41.78,46.35 43.94,48.51 MOTORB_2.1
N$1  (via drill 0.33)
  Top 0.254: v23.75,48.51 24.13,48.9 LED3.A
  Bottom 0.254: R1.1 v23.75,48.51
N$4
  Top 0.33: U$2.9 22.81,13.03 R7.1
N$5
  Top 0.508: R20.1 1.14,40.45 LED5.A
N$8
  Top 0.254: R21.1 LED4.A
N$9
  Top 0.254: FTDI.9 9.67,28.3 11.18,26.8 RST_JMPR.2
  Bottom 0.254: R46.1 11.24,27.37 RST_JMPR.2
N$10
  Top 0.254: R47.1 LED10.A
N$11
  Top 0.33: U$2.6 20.86,13.17 R6.1
N$16
  Top 0.203: U$2.2 18.26,18.44 18.16,18.54 16.45,18.54 C7.2
N$17
  Top 0.203: C7.1 16.91,16.89 U$2.1
N$19
  Top 0.203: U$2.3 18.91,16.75 18.54,16.38 17.98,16.38 C8.1
N$20
  Top 0.203: U$2.13 U$2.14 27.54,17.59 R9.1 R8.2
N$21
  Top 0.33: U$3.9 38.4,39.45 R12.1
N$22
  Top 0.33: U$3.6 38.39,37.5 R11.1
N$27
  Top 0.33: U$3.2 33.12,34.9 32.89,34.67 32.89,33.09 C13.2
N$28
  Top 0.33: U$3.1 33.84,33.44 C13.1
N$29
  Top 0.33: U$3.3 34.55,35.55 35.05,35.05 35.05,34.62 C14.1
N$30
  Top 0.203: U$3.13 U$3.14 | R14.1 R13.2
  Top 0.254: U$3.14 33.84,44.18 R14.1
NFAULT_1
  Top 0.254: U$2.18 24.11,26.1 R10.1
NFAULT_2  (via drill 0.33)
  Top 0.254: 27.65,40.77 U$3.18 25.64,40.75 25.11,41.27 v24.77,41.27
  Bottom 0.254: R15.1 26.59,44.11 24.77,42.29 v24.77,41.27
NSLEEP_1  (via drill 0.33)
  Top 0.254: U$2.17 24.76,24.76 25.27,25.27 25.27,27.56 v22.99,29.84 | v16.51,29.84 16.51,35.89 U$4.2
  Bottom 0.254: v22.99,29.84 v16.51,29.84
NSLEEP_2  (via drill 0.33)
  Top 0.254: U$4.15 24.71,39.5 25.27,39.5 25.65,39.88 v26.04,39.88 | v26.16,41.53 26.29,41.4 U$3.17
  Bottom 0.254: v26.04,39.88 26.16,40.01 v26.16,41.53
QEIA1_1  (via drill 0.33)
  Top 0.254: MOTORA_1.5 6.6,2.79 7.24,2.16 33.91,2.16 34.92,3.17 34.92,6.86 32.26,9.53 32.26,25.4 25.91,31.75 v23.88,31.75 | v18.54,31.75 18.54,34.16 19,34.62 U$4.6
  Bottom 0.254: v23.88,31.75 v18.54,31.75
QEIA1_2  (via drill 0.33)
  Top 0.254: MOTORA_1.6 4.06,3.05 5.46,1.65 34.16,1.65 35.43,2.92 35.43,7.11 32.77,9.78 32.77,25.65 26.04,32.38 v22.99,32.38 | v19.18,32.38 19.18,33.91 19.47,34.2 U$4.7
  Bottom 0.254: v22.99,32.38 v19.18,32.38
QEIA2_1  (via drill 0.33)
  Top 0.254: v39.75,46.74 39.12,47.37 29.84,47.37 29.59,47.12 29.27,46.8 25.02,42.55 24.06,42.55 U$4.19
  Bottom 0.254: v39.75,46.74 40.01,46.74 41.78,44.96 41.78,24.26 43.56,22.48 MOTORA_2.5
QEIA2_2  (via drill 0.33)
  Top 0.254: v38.99,46.1 38.23,46.86 30.23,46.86 25.4,42.04 24.49,42.04 U$4.18
  Bottom 0.254: v38.99,46.1 41.27,43.81 41.27,21.34 42.8,19.81 44.58,19.81 MOTORA_2.6
QEIB1_1  (via drill 0.33)
  Top 0.254: MOTORB_1.5 22.48,3.56 22.86,3.17 33.4,3.17 33.91,3.68 33.91,6.22 32.51,7.62 32.51,7.75 31.24,9.02 31.24,24.64 25.4,30.48 v24,30.48 | v17.14,30.48 17.14,35.56 17.62,36.03 U$4.3
  Bottom 0.254: v24,30.48 v17.14,30.48
QEIB1_2  (via drill 0.33)
  Top 0.254: MOTORB_1.6 19.94,3.43 20.7,2.67 33.66,2.67 34.42,3.43 34.42,6.6 31.75,9.27 31.75,25.02 25.65,31.11 v23.11,31.11 | v17.91,31.11 17.65,31.37 17.65,35.18 18.09,35.61 U$4.4
  Bottom 0.254: v23.11,31.11 v17.91,31.11
QEIB2_1  (via drill 0.33)
  Top 0.254: v41.91,47.62 41.15,48.39 29.21,48.39 24.38,43.56 23.25,43.56 U$4.21
  Bottom 0.254: MOTORB_2.5 43.05,38.35 42.8,38.61 42.8,46.74 v41.91,47.62
QEIB2_2  (via drill 0.33)
  Top 0.254: v40.77,47.24 40.13,47.88 29.46,47.88 24.64,43.05 23.67,43.05 U$4.20
  Bottom 0.254: MOTORB_2.6 44.7,35.94 42.29,38.35 42.29,45.72 v40.77,47.24
RX  (via drill 0.33)
  Top 0.254: FTDI.26 10.17,41.79 11.94,43.56 v14.73,43.56 | U$4.22 20.45,42.09 v20.45,42.8
  Bottom 0.254: v20.45,42.8 19.68,43.56 v14.73,43.56
STATUS1  (via drill 0.33)
  Top 0.254: U$4.27 16.61,39.37 v16.13,39.37
  Bottom 0.254: v16.13,39.37 18.67,41.91 20.57,41.91 22.35,43.69 22.35,47.12 21.91,47.56 R1.2
TX  (via drill 0.33)
  Top 0.254: U$4.23 18.54,41.11 18.54,41.66 v19.43,42.55 | v13.97,42.93 12.19,42.93 10.67,41.4 FTDI.25
  Bottom 0.254: v19.43,42.55 19.05,42.93 v13.97,42.93
V3P3_1
  Top 0.203: 29.06,18.67 R8.1 | 26.06,26.74 R10.2
  Top 0.254: R8.1 29,19.27 27.81,20.45 27.81,21.39 C11.1 27.71,22.12 U$2.15 26.06,25.59 R10.2
V3P3_2  (via drill 0.33)
  Top 0.254: 32.67,45.59 R13.1 32.49,45.85 v31.37,45.85 30.28,45.85 C17.1 | U$3.15 27.69,42.67 28.7,42.67 30.35,44.32 30.35,44.96 29.92,45.39 C17.1 | 30.07,45.49 C17.1
  Bottom 0.254: R15.2 30.45,45.85 v31.37,45.85
VBUS
  Top 0.203: 4.2,32.13 BT_USB_MICROB1.VBUS
  Top 0.254: 4.2,32.13 3.05,32.13 2.92,32 2.92,29.21 3.05,28.96 | 2.09,24.45 2.02,24.49 | 2.02,24.49 R47.2 | FTDI.8 7.4,26.92 JP1.1 | 4.57,26.92 4.45,26.92 2.02,24.49
  Top 0.762: 3.05,28.96 3.05,28.45 4.57,26.92 JP1.1

### Text on the board
tNames: NCSU Robotics Club | QEI1 | QEI2 | +5V | GND